# Altium project TRACTIAN_IoT.PrjPcb (part 1 of 3)
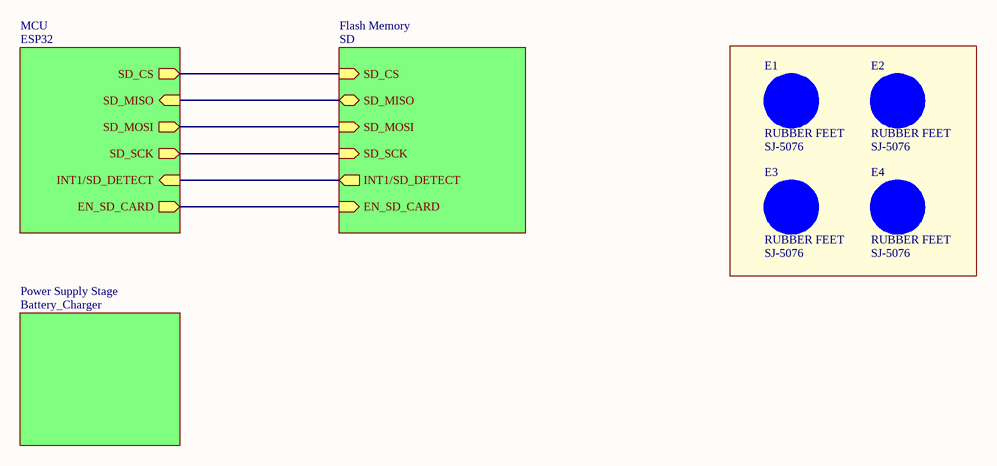
[diagram p0: main.SchDoc]
4 sheets, 60 parts. Net scope: hierarchical (ports join the sheet entries above them; power ports are global).
Board file: Tractian_IoT.PcbDoc
Sheets:
  main.SchDoc
    MCU = ESP32.SchDoc
    Power Supply Stage = Battery_Charger.SchDoc
    Flash Memory = SD.SchDoc

## Sheet main.SchDoc
size A4; SheetNumber: 1; SheetTotal: 4

### Parts
E1  RUBBER FEET  value SJ-5076  [AP8-00192]
E2  RUBBER FEET  value SJ-5076  [AP8-00192]
E3  RUBBER FEET  value SJ-5076  [AP8-00192]
E4  RUBBER FEET  value SJ-5076  [AP8-00192]

### Sub-sheets
Flash Memory = SD: INT1/SD_DETECT (out), SD_MOSI (in), EN_SD_CARD (in), SD_MISO (bidir), SD_CS (in), SD_SCK (in)
MCU = ESP32: SD_CS (out), SD_MISO (in), SD_MOSI (out), SD_SCK (out), INT1/SD_DETECT (in), EN_SD_CARD (out)
Power Supply Stage = Battery_Charger: no entries

### Nets
IO4: sheet MCU/INT1/SD_DETECT, sheet Flash Memory/INT1/SD_DETECT
IO5: sheet MCU/SD_CS, sheet Flash Memory/SD_CS
IO13: sheet MCU/EN_SD_CARD, sheet Flash Memory/EN_SD_CARD
IO18: sheet MCU/SD_SCK, sheet Flash Memory/SD_SCK
IO19: sheet MCU/SD_MISO, sheet Flash Memory/SD_MISO
IO23: sheet MCU/SD_MOSI, sheet Flash Memory/SD_MOSI

### Library data of the parts
E1-E4 = RUBBER FEET: 2.8mm adhesive feet,diam 8.0mm; PartGroup: Mechanical devices,Mounting accessories; Manufacturer: 3M; AN: A08-0053; ComponentStatus: 'Active (verified)'; Verified date: 2006-05-05; Verified by: Ketil Skjerve; Status: Active; Height: 2.79999995231628; FootprintStatus: 'Active (Verified)'

## Sheet ESP32.SchDoc
size A3; SheetNumber: 2; SheetTotal: 4
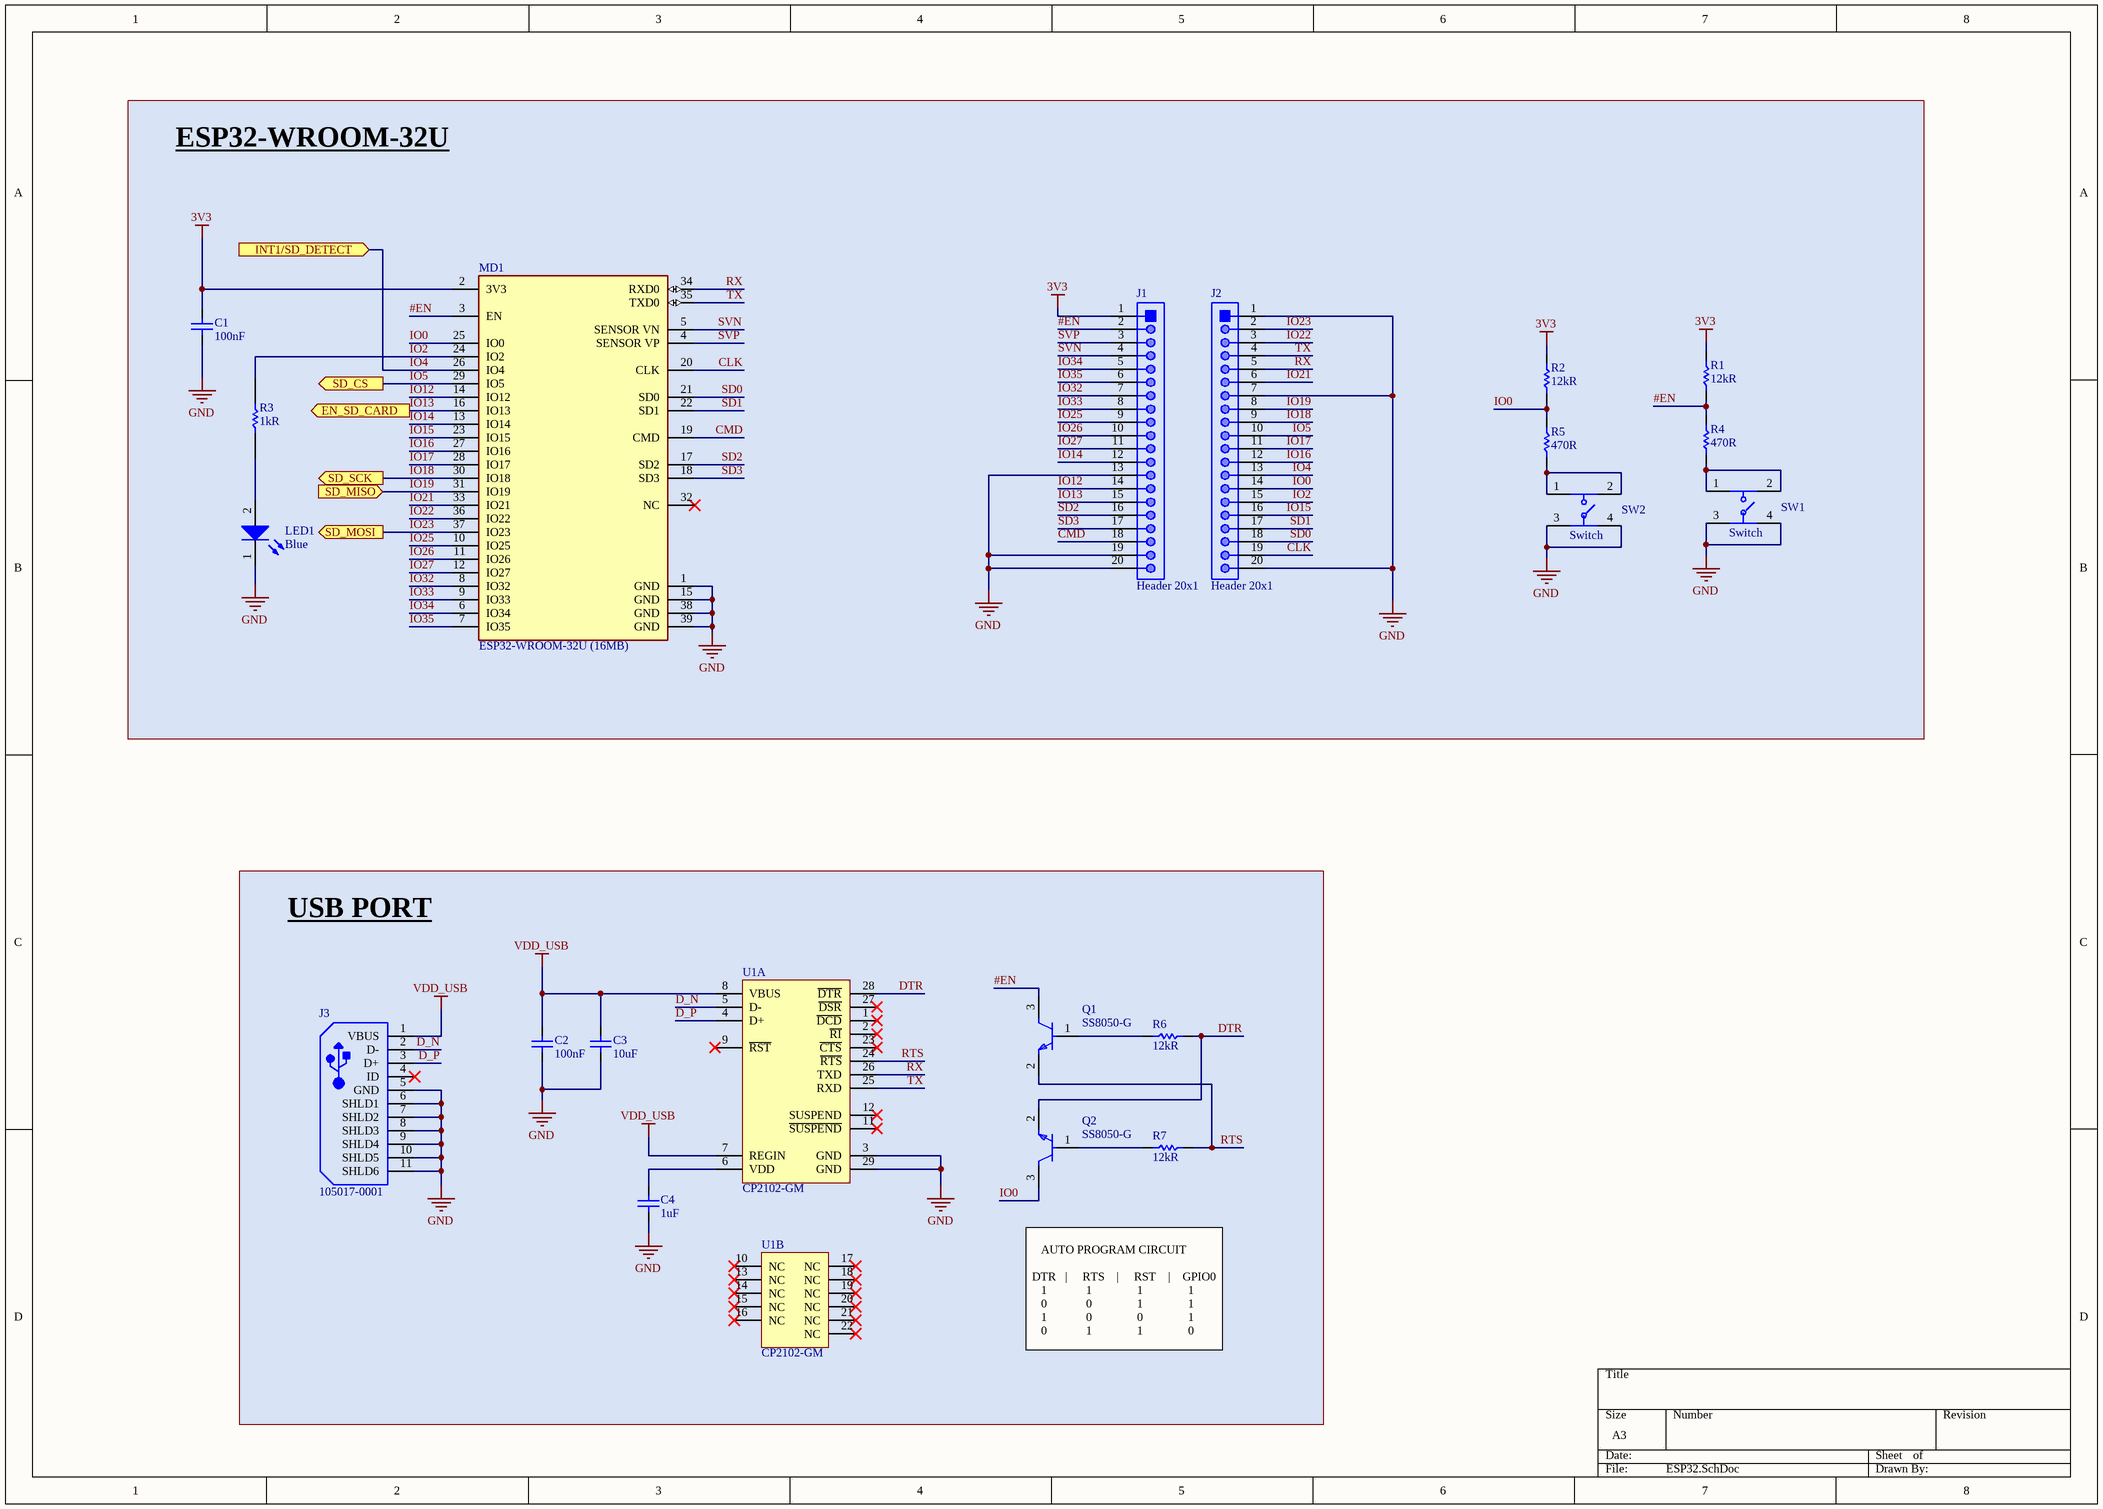
[diagram p1: ESP32.SchDoc]

### Parts
C1  100nF  [Cap 0805 (2012 Metric)]
C2  100nF  [Cap 0805 (2012 Metric)]
C3  10uF  [Cap 0805 (2012 Metric)]
C4  1uF  [Cap 0805 (2012 Metric)]
J1  Header 20x1  [Header 20x1]
J2  Header 20x1  [Header 20x1]
J3  105017-0001  [USB-MICRO-B_V]
LED1  Blue  [LED 0805(2012 METRIC)]
MD1  ESP32-WROOM-32U (16MB)  [FP-ESP32-WROOM-32U_16MB-MFG]
Q1  SS8050-G  [FP-SS8050-G-MFG]
Q2  SS8050-G  [FP-SS8050-G-MFG]
R1  12kR  [Res 0805 (2012 Metric)]
R2  12kR  [Res 0805 (2012 Metric)]
R3  1kR  [Res 0805 (2012 Metric)]
R4  470R  [Res 0805 (2012 Metric)]
R5  470R  [Res 0805 (2012 Metric)]
R6  12kR  [Res 0805 (2012 Metric)]
R7  12kR  [Res 0805 (2012 Metric)]
SW1  Switch  [Sw 4 (4.5 X 4.5mm)]
SW2  Switch  [Sw 4 (4.5 X 4.5mm)]
U1  CP2102-GM  [SLAB-QFN-28-3125x3125TP_N]  (parts A,B of 2)

### Blocks framed on the sheet
ESP32-WROOM-32U: C1 J1 J2 LED1 MD1 R1-R5 SW1 SW2
USB PORT: C2-C4 J3 Q1 Q2 R6 R7 U1

### Ports
EN_SD_CARD (out), INT1/SD_DETECT (in), SD_CS (out), SD_MISO (in), SD_MOSI (out), SD_SCK (out)

### Nets
3V3: C1.1 J1.1 MD1.2(3V3) R1.2 R2.2
GND: C1.2 C2.2 C3.2 C4.2 J1.13 J1.19 J1.20 J2.1 J2.7 J2.20 J3.5(GND) J3.6(SHLD1) J3.7(SHLD2) J3.8(SHLD3) J3.9(SHLD4) J3.10(SHLD5) J3.11(SHLD6) LED1.1(K) MD1.1(GND) MD1.15(GND) MD1.38(GND) MD1.39(GND) SW1.3 SW1.4 SW2.3 SW2.4 U1.3(GND) U1.29(GND)
VDD_USB: C2.1 C3.1 J3.1(VBUS) U1.7(REGIN) U1.8(VBUS)
#EN: J1.2 MD1.3(EN) Q1.3(C) R1.1 R4.1
CLK: J2.19 MD1.20(CLK)
CMD: J1.18 MD1.19(CMD)
D_N: J3.2(D-) U1.5(D-)
D_P: J3.3(D+) U1.4(D+)
DTR: Q2.2(E) R6.1 U1.28(~{DTR})
IO0: J2.14 MD1.25(IO0) Q2.3(C) R2.1 R5.1
IO2: J2.15 MD1.24(IO2) R3.1
IO4: J2.13 MD1.26(IO4) ; port INT1/SD_DETECT
IO5: J2.10 MD1.29(IO5) ; port SD_CS
IO12: J1.14 MD1.14(IO12)
IO13: J1.15 MD1.16(IO13) ; port EN_SD_CARD
IO14: J1.12 MD1.13(IO14)
IO15: J2.16 MD1.23(IO15)
IO16: J2.12 MD1.27(IO16)
IO17: J2.11 MD1.28(IO17)
IO18: J2.9 MD1.30(IO18) ; port SD_SCK
IO19: J2.8 MD1.31(IO19) ; port SD_MISO
IO21: J2.6 MD1.33(IO21)
IO22: J2.3 MD1.36(IO22)
IO23: J2.2 MD1.37(IO23) ; port SD_MOSI
IO25: J1.9 MD1.10(IO25)
IO26: J1.10 MD1.11(IO26)
IO27: J1.11 MD1.12(IO27)
IO32: J1.7 MD1.8(IO32)
IO33: J1.8 MD1.9(IO33)
IO34: J1.5 MD1.6(IO34)
IO35: J1.6 MD1.7(IO35)
RTS: Q1.2(E) R7.1 U1.24(~{RTS})
RX: J2.5 MD1.34(RXD0) U1.26(TXD)
SD0: J2.18 MD1.21(SD0)
SD1: J2.17 MD1.22(SD1)
SD2: J1.16 MD1.17(SD2)
SD3: J1.17 MD1.18(SD3)
SVN: J1.4 MD1.5(SENSOR_VN)
SVP: J1.3 MD1.4(SENSOR_VP)
TX: J2.4 MD1.35(TXD0) U1.25(RXD)
NetC4_1: C4.1 U1.6(VDD)
NetLED1_2: LED1.2(A) R3.2
NetQ1_1: Q1.1(B) R6.2
NetQ2_1: Q2.1(B) R7.2
NetR4_2: R4.2 SW1.1 SW1.2
NetR5_2: R5.2 SW2.1 SW2.2

Not connected (* = marked no-connect by the designer): J3 4(ID)*; MD1 32(NC)*; U1 1(~{DCD})* 2(~{RI})* 9(~{RST})* 10(NC)* 11(~{SUSPEND})* 12(SUSPEND)* 13(NC)* 14(NC)* 15(NC)* 16(NC)* 17(NC)* 18(NC)* 19(NC)* 20(NC)* 21(NC)* 22(NC)* 23(~{CTS})* 27(~{DSR})*

### Notes on the sheet
- AUTO PROGRAM CIRCUIT
  DTR   |     RTS    |     RST    |    GPIO0
  1             1               1               1
  0             0               1               1
  1             0               0               1
  0             1               1               0

### Library data of the parts
C1 C2 = Capacitor: YAGEO (PHYCOMP)         CC0805ZRY5V9BB104             SMD Multilayer Ceramic Capacitor, 0805 [2012 Metric], 0.1 uF, 50 V, +80%, -20%, Y5V, CC Series; Tolerance: 80%; Voltage Rating: 50V; Link: https://www.digikey.com/es/products/detail/yageo/CC0805ZRY5V9BB104/2103099?s=N4IgTCBcDaIMJwAwA5EFYBaAlAmmgagJwBCxAjIgCwgC6AvkA; Supplier 1: Digi-Key; Supplier Part Number 1: 311-1361-1-ND; Manufacturer: Yageo; Manufacturer Part Number: CC0805ZRY5V9BB104; RoHS: Yes; Category: Ceramic Capacitors; Stock 1: 92689; Pricing 1: 1=0,10000, 10=0,07000, 50=0,03800, 100=0,03100, 500=0,02214, 1000=0,01739 (USD); Mount: Surface Mount; Case/Package: 0805; Number of Pins: 2; Case Code (Metric): 2012; Case Code (Imperial): 0805; Material: Ceramic; Dielectric Material: Ceramic; Min Operating Temperature: -30°C; Max Operating Temperature: 85°C; Capacitance: 100nF; Dielectric: Y5V; Package Quantity: 1; Packaging: Tape and Reel; Voltage Rating (DC): 50V; Termination: SMD/SMT; Resistor Type: Ceramic; Series: CC; Construction: Flat; Length: 2mm; Width: 0.049inch; Height: 0.6mm; Depth: 1.25mm; Thickness: 0.024inch; Radiation Hardening: No; REACH SVHC: No SVHC; Lead Free: Lead Free; Halogen Free: Halogen Free; RoHS Compliant: Yes; ComponentLink1URL: https://datasheet.ciiva.com/144/mlccorderingcode-144209.pdf?src-supplier=Digi-Key; ComponentLink1Description: https://datasheet.ciiva.com/144/mlccorderingcode-144209.pdf?src-supplier=Digi-Key; ComponentLink2URL: https://datasheet.ciiva.com/144/mlccorderingcode-144210.pdf?src-supplier=Digi-Key; ComponentLink2Description: https://datasheet.ciiva.com/144/mlccorderingcode-144210.pdf?src-supplier=Digi-Key; ComponentLink3URL: https://datasheet.ciiva.com/144/mlccorderingcode-144211.pdf?src-supplier=Digi-Key; ComponentLink3Description: https://datasheet.ciiva.com/144/mlccorderingcode-144211.pdf?src-supplier=Digi-Key; ComponentLink4URL: https://datasheet.ciiva.com/11465/upy-gphc-y5v-6-3v-to-50v-5-11465865.pdf?src-supplier=Avnet; ComponentLink4Description: https://datasheet.ciiva.com/11465/upy-gphc-y5v-6-3v-to-50v-5-11465865.pdf?src-supplier=Avnet; ComponentLink5URL: https://datasheet.ciiva.com/13389/upy-gp-np0-16v-to-50v-8-13389351.pdf?src-supplier=Mouser; ComponentLink5Description: https://datasheet.ciiva.com/13389/upy-gp-np0-16v-to-50v-8-13389351.pdf?src-supplier=Mouser; ComponentLink6URL: https://datasheet.ciiva.com/17435/upy-gphc-y5v-6-3v-to-50v-5-17435053.pdf?src-supplier=Avnet+Europe; ComponentLink6Description: https://datasheet.ciiva.com/17435/upy-gphc-y5v-6-3v-to-50v-5-17435053.pdf?src-supplier=Avnet+Europe; ComponentLink7URL: https://datasheet.ciiva.com/15189/getdatasheetpartid-55882-15189238.pdf?src-supplier=Verical; ComponentLink7Description: https://datasheet.ciiva.com/15189/getdatasheetpartid-55882-15189238.pdf?src-supplier=Verical; ComponentLink8URL: https://datasheet.ciiva.com/16747/upy-gphc-y5v-6-3v-to-50v-5-revised-16747323.pdf?src-supplier=Future+Electronics; ComponentLink8Description: https://datasheet.ciiva.com/16747/upy-gphc-y5v-6-3v-to-50v-5-revised-16747323.pdf?src-supplier=Future+Electronics; ComponentLink9URL: https://datasheet.ciiva.com/28450/1132289-28450870.pdf?src-supplier=Element14; ComponentLink9Description: https://datasheet.ciiva.com/28450/1132289-28450870.pdf?src-supplier=Element14; ComponentLink10URL: https://datasheet.ciiva.com/29241/445331-da-01-en-kerko-chip-0805-y5v0-1uf-20-80proz50vg-29241946.pdf?src-supplier=Conrad; ComponentLink10Description: https://datasheet.ciiva.com/29241/445331-da-01-en-kerko-chip-0805-y5v0-1uf-20-80proz50vg-29241946.pdf?src-supplier=Conrad
C3 = Capacitor: CAP CER 10UF 10V X5R 0805; Manufacturer: KEMET; Manufacturer Part Number: C0805C106K8PACTU; Dielectric Material: Ceramic; Tolerance: 10%; Link: https://www.digikey.com/es/products/detail/kemet/C0805C106K8PACTU/1090830?s=N4IgTCBcDaIMIAYAcCCscCMCBsBpJACgIJwAqAqiALoC%2BQA; Supplier 1: Digi-Key; Supplier Part Number 1: 399-4925-1-ND; RoHS: Yes; Category: Ceramic Capacitors; Stock 1: 1166327; Pricing 1: 1=0,15000, 10=0,10600, 50=0,06040, 100=0,05000, 500=0,03508, 1000=0,02904 (USD); Mount: Surface Mount; Case/Package: 0805; Number of Pins: 2; Case Code (Imperial): 0805; Case Code (Metric): 2012; Contact Plating: Tin,Matte; Min Operating Temperature: -55°C; Max Operating Temperature: 85°C; Capacitance: 10uF; Packaging: Tape and Reel; Voltage Rating (DC): 10V; Termination: SMD/SMT; Package Quantity: 1; Voltage Rating: 10V; Voltage: 10V; Series: C; Dielectric: X5R; Construction: Flat; Dissipation Factor: 10%; Length: 2mm; Width: 1.2mm; Height: 1.25mm; Depth: 1.25mm; Thickness: 0.055inch; Radiation Hardening: No; REACH SVHC: No SVHC; RoHS Compliant: Yes; ComponentLink1URL: https://datasheet.ciiva.com/7842/1732709-7842198.pdf?src-supplier=Element14; ComponentLink1Description: https://datasheet.ciiva.com/7842/1732709-7842198.pdf?src-supplier=Element14; ComponentLink2URL: https://datasheet.ciiva.com/7842/40889-7842552.pdf?src-supplier=Element14; ComponentLink2Description: https://datasheet.ciiva.com/7842/40889-7842552.pdf?src-supplier=Element14; ComponentLink3URL: https://datasheet.ciiva.com/22704/1732709-22704859.pdf?src-supplier=Element14; ComponentLink3Description: https://datasheet.ciiva.com/22704/1732709-22704859.pdf?src-supplier=Element14
C4 = Capacitor: Ceramic capacitor SMD-0805 1000nF /16V X7R# K +-10%, Samsung, RoHS/3000pcs/; Manufacturer Part Number: CL21B105KOFNNNG; Voltage Rating: 16V; Tolerance: 10%; Dielectric: X7R; Link: https://www.digikey.com/es/products/detail/samsung-electro-mechanics/CL21B105KOFNNNG/3894469?s=N4IgTCBcDaIMIBkwEYBCyAMBWA0geQDEA5EgcRAF0BfIA; Supplier 1: Digi-Key; Supplier Part Number 1: 1276-6471-1-ND; Manufacturer: Samsung; RoHS: Yes; Category: Ceramic Capacitors; Stock 1: 36000; Pricing 1: 1=0,10000, 10=0,05700, 50=0,03120, 100=0,02540, 500=0,01816, 1000=0,01426 (USD); Mount: Surface Mount; Case/Package: 0805; Case Code (Metric): 2012; Case Code (Imperial): 0805; Material: Ceramic; Min Operating Temperature: -55°C; Max Operating Temperature: 125°C; Package Quantity: 3000; Packaging: Tape and Reel; Capacitance: 1uF; Voltage: 16V; Series: CL; Length: 2mm; Width: 0.049inch; Height: 1.25mm; Thickness: 0.053inch; Depth: 1.25mm; Lead Free: Lead Free; ComponentLink1URL: https://datasheet.ciiva.com/25733/cl21b105kofnnng-25733281.pdf?src-supplier=Digi-Key; ComponentLink1Description: https://datasheet.ciiva.com/25733/cl21b105kofnnng-25733281.pdf?src-supplier=Digi-Key; ComponentLink2URL: https://datasheet.ciiva.com/29199/455935-da-01-en-vs-kondensator-0805-29199047.pdf?src-supplier=Conrad; ComponentLink2Description: https://datasheet.ciiva.com/29199/455935-da-01-en-vs-kondensator-0805-29199047.pdf?src-supplier=Conrad; ComponentLink3URL: https://datasheet.ciiva.com/16428/cl05b104kq5nnnc-16428885.pdf?src-supplier=Future+Electronics; ComponentLink3Description: https://datasheet.ciiva.com/16428/cl05b104kq5nnnc-16428885.pdf?src-supplier=Future+Electronics; ComponentLink4URL: https://datasheet.ciiva.com/26310/mlcc-catalogdownload2013-eng-26310156.pdf?src-supplier=Distrelec; ComponentLink4Description: https://datasheet.ciiva.com/26310/mlcc-catalogdownload2013-eng-26310156.pdf?src-supplier=Distrelec
J3 = CMP-2000-05827-1: Micro-USB B Receptacle, Right Angle, Bottom Mount, Surface Mount, with Solder Tabs, -30 to 85 degC, 5-Pin USB, RoHS, Tape and Reel; Manufacturer: Molex; Featured Product: Micro-USBConnectorsUSBConnectors; Other Names: WM1399DKR; Package Version: Rev. F, 12/2012; Number of Contacts: 5; Connector Type: USB-microB; Catalog Drawings: 1050170001; 3D Model: 105017-0001.stp; Mating Products: WM17145-ND-CABLEMICROUSBBTOSTDA1.0MWM17147-ND-CABLEMICROUSBBTOSTDA2.0MWM17146-ND-CABLEMICROUSBBTOSTDA1.5M; PCN Assembly/Origin: ResinSupplier21/Oct/2015; Voltage - Max: 30V; Online Catalog: Molex-MicroUSB; Manufacturer URL: http://www.molex.com/; Package Description: 5-Leads USB, Micro B, Body 7.5 x 5 mm, Pitch 0.65 mm; Datasheet URL: http://www.molex.com/elqNow/elqRedir.htm?ref=http://www.molex.com/webdocs/datasheets/pdf/en-us/1050170001_IO_CONNECTORS.pdf; Ingress Protection: -; Datasheet Version: 03/2016; Mounting Type: BoardCutout,SurfaceMount,RightAngle; Circuits: 5; Standard Package: 1; Package Reference: MICRO-B; Package URL: http://www.molex.com/pdm_docs/sd/1050170001_sd.pdf; Category: Connectors,Interconnects; Series: -; RoHS Information: 1050170001CertofCompliance; Features: Shielded,SolderRetention; Family: USB,DVI,HDMIConnectors; Specifications: -; Gender: Receptacle; Packaging: Digi-Reel®; Mounting Technology: SurfaceMount; Manufacturer Part Number: 1050170001; Link: https://www.digikey.com/es/products/detail/molex/1050170001/2350832?s=N4IgTCBcDaIIwAYCsC4HYC0DtxAXQF8g
LED1 = LED: SMD LED blue 3.5 V 0805, 150080BS75000, Würth Elektronik; Manufacturer: Wurth Electronics; Luminous Intensity: 145mcd; Viewing Angle: 140°; Forward Voltage: 3.2V; Wavelength: 470nm; Lens Style: Clear,Rectangular; Forward Current: 30mA; Test Current: 20mA; Link: https://www.digikey.com/products/en/optoelectronics/led-indication-discrete/105?k=150080BS75000&k=&pkeyword=150080BS75000&sv=0&pv7=2&sf=0&quantity=&ColumnSort=0&page=1&pageSize=25; Supplier 1: Digi-Key; Supplier Part Number 1: 732-4982-1-ND; Manufacturer Part Number: 150080BS75000; RoHS: Yes; Category: LEDs; Stock 1: 30224; Pricing 1: 1=0,18000, 50=0,16500, 100=0,14200, 500=0,12300 (USD); Mount: Surface Mount; Case/Package: 0805; Color: Blue; Case Code (Metric): 2012; Case Code (Imperial): 0805; Min Operating Temperature: -40°C; Max Operating Temperature: 85°C; Package Quantity: 4000; Packaging: Tape and Reel; Dominant Wavelength: 470nm; Length: 2mm; Height: 0.7mm; Width: 1.25mm; REACH SVHC: Unknown; Lead Free: Lead Free; ComponentLink1URL: https://datasheet.ciiva.com/23843/150080bs75000-23843251.pdf?src-supplier=Newark; ComponentLink1Description: https://datasheet.ciiva.com/23843/150080bs75000-23843251.pdf?src-supplier=Newark; ComponentLink2URL: https://datasheet.ciiva.com/22656/1740214-22656954.pdf?src-supplier=Element14; ComponentLink2Description: https://datasheet.ciiva.com/22656/1740214-22656954.pdf?src-supplier=Element14; ComponentLink3URL: https://datasheet.ciiva.com/29279/759433-da-01-en-chipled-0805-w-kl-blau-150080bs75000-29279203.pdf?src-supplier=Conrad; ComponentLink3Description: https://datasheet.ciiva.com/29279/759433-da-01-en-chipled-0805-w-kl-blau-150080bs75000-29279203.pdf?src-supplier=Conrad; ComponentLink4URL: https://datasheet.ciiva.com/29562/150080bs75000-29562922.pdf?src-supplier=Digi-Key; ComponentLink4Description: https://datasheet.ciiva.com/29562/150080bs75000-29562922.pdf?src-supplier=Digi-Key; ComponentLink5URL: https://datasheet.ciiva.com/29562/150080bs75000-29562923.pdf?src-supplier=Digi-Key; ComponentLink5Description: https://datasheet.ciiva.com/29562/150080bs75000-29562923.pdf?src-supplier=Digi-Key
MD1 = CMP-194065-000029-1: RX TXRX MODULE WIFI U.FL SMD; Manufacturer Part Number: ESP32-WROOM-32U-N4; Sensitivity: -98dBm; Frequency: 2.5GHz; Memory Size: 536KB; Data Rate: 150Mbps; Interface: I2C; Packaging: Tape and Reel; Case/Package: SMD/SMT; Max Operating Temperature: 85°C; Mount: Surface Mount; Min Operating Temperature: -40°C; Link: https://www.digikey.com/es/products/detail/espressif-systems/ESP32-WROOM-32U-N4/9381719
Q1 Q2 = CMP-20235-000001-1: NPN TRANSISTOR 1.5A 40V SOT-23 R; Transition Frequency: 100MHz; Max Breakdown Voltage: 25V; Collector Emitter Voltage (VCEO): 400mV; Max Power Dissipation: 300mW; Max Collector Current: 1.5A; Case/Package: TO-236-3; Packaging: Tape and Reel; RoHS Compliant: Yes; Mount: Surface Mount; Collector Emitter Breakdown Voltage: 25V; Manufacturer Part Number: SS8050-G; Link: https://www.digikey.com/es/products/detail/comchip-technology/SS8050-G/6138901?s=N4IgTCBcDaIMpwBwAYCsyC0BxEBdAvkA
R1 R2 R6 R7 = Resistor: 贴片电阻 12000Ω ± 1.00% 0.125W ± 100ppm/℃ 0805; Manufacturer: Yageo; Manufacturer Part Number: RC0805FR-0712KL; Tolerance: 1%; Temperature Coefficient: 100ppm/°C; Max Power Dissipation: 125mW; Voltage Rating: 150V; Link: https://www.digikey.com/es/products/detail/yageo/RC0805FR-0712KL/727568?s=N4IgTCBcDaIEoGEAMAOJBWAYnAtEg7AIxgDSAMiALoC%2BQA; Supplier 1: RSComponents; Supplier Part Number 1: 1995652; RoHS: Yes; Category: Chip SMD Resistors; Stock 1: 300; Pricing 1: 5000=0,00400, 25000=0,00400, 50000=0,00400, 100000=0,00300, 200000=0,00300 (GBP); Case/Package: 0805; Case Code (Imperial): 0805; Case Code (Metric): 2012; Weight: 0.000194oz; Size Code: 0805; Min Operating Temperature: -55°C; Max Operating Temperature: 155°C; Resistance: 12kR; Packaging: Tape and Reel; Package Quantity: 1; Resistor Type: Thick Film; Number of Terminations: 2; Series: RC; Features: Moisture Resistant; Power Rating: 125mW; Termination: SMD/SMT; Construction: Rectangular; Resistance Tolerance: 1%; Length: 2mm; Width: 1.25mm; Height: 0.024inch; Depth: 1.25mm; RoHS Compliant: Yes; Lead Free: Lead Free; Military Standard: Not; REACH SVHC: Unknown; ComponentLink1URL: https://datasheet.ciiva.com/2519/pyu-r-int-thick-7-2519832.pdf?src-supplier=Digi-Key; ComponentLink1Description: https://datasheet.ciiva.com/2519/pyu-r-int-thick-7-2519832.pdf?src-supplier=Digi-Key; ComponentLink2URL: https://datasheet.ciiva.com/2519/pyu-r-int-thick-7-2519833.pdf?src-supplier=Digi-Key; ComponentLink2Description: https://datasheet.ciiva.com/2519/pyu-r-int-thick-7-2519833.pdf?src-supplier=Digi-Key; ComponentLink3URL: https://datasheet.ciiva.com/2519/pyu-r-int-thick-7-2519831.pdf?src-supplier=Digi-Key; ComponentLink3Description: https://datasheet.ciiva.com/2519/pyu-r-int-thick-7-2519831.pdf?src-supplier=Digi-Key; ComponentLink4URL: https://datasheet.ciiva.com/12577/rc0805-12577253.pdf?src-supplier=Mouser; ComponentLink4Description: https://datasheet.ciiva.com/12577/rc0805-12577253.pdf?src-supplier=Mouser; ComponentLink5URL: https://datasheet.ciiva.com/7941/444164-7941693.pdf?src-supplier=Element14; ComponentLink5Description: https://datasheet.ciiva.com/7941/444164-7941693.pdf?src-supplier=Element14; ComponentLink6URL: https://datasheet.ciiva.com/7941/444164-7941694.pdf?src-supplier=Element14; ComponentLink6Description: https://datasheet.ciiva.com/7941/444164-7941694.pdf?src-supplier=Element14; ComponentLink7URL: https://datasheet.ciiva.com/17018/rc0805-17018634.pdf?src-supplier=Future+Electronics; ComponentLink7Description: https://datasheet.ciiva.com/17018/rc0805-17018634.pdf?src-supplier=Future+Electronics
R3 = Resistor: 1 kOhms ±1% 0.25W, 1/4W Chip Resistor 0805 (2012 Metric) Anti-Sulfur, Moisture Resistant Thin Film; Manufacturer: Stackpole Electronics; Manufacturer Part Number: RNCP0805FTD1K00; Max Power Dissipation: 250mW; Temperature Coefficient: 100ppm/°C; Link: https://www.digikey.com/product-detail/en/stackpole-electronics-inc/RNCP0805FTD1K00/RNCP0805FTD1K00CT-ND/2240568; Supplier 1: Digi-Key; Supplier Part Number 1: RNCP0805FTD1K00CT-ND; RoHS: Yes; Category: Chip SMD Resistors; Stock 1: 391019; Pricing 1: 1=0,10000, 10=0,06900, 100=0,02640, 1000=0,01162, 2500=0,01003 (USD); Mount: Surface Mount; Case/Package: 0805; Case Code (Metric): 2012; Case Code (Imperial): 0805; Min Operating Temperature: -55°C; Max Operating Temperature: 155°C; Features: Moisture Resistant,Anti-Sulfur; Composition: Thin Film; Number of Terminations: 2; Tolerance: 1%; Resistance: 1kR; Power Rating: 250mW; Packaging: Tape and Reel; Length: 0.079inch; Height: 0.024inch; Width: 0.049inch; Lead Free: Lead Free; ComponentLink1URL: http://www.seielect.com/Catalog/SEI-rncp.pdf?src-supplier=Future+Electronics; ComponentLink1Description: http://www.seielect.com/Catalog/SEI-rncp.pdf?src-supplier=Future+Electronics; ComponentLink2URL: https://www.seielect.com/catalog/SEI-Packaging.pdf?src-supplier=Digi-Key; ComponentLink2Description: https://www.seielect.com/catalog/SEI-Packaging.pdf?src-supplier=Digi-Key; ComponentLink3URL: https://www.seielect.com/Catalog/SEI-rncp.pdf?src-supplier=Digi-Key; ComponentLink3Description: https://www.seielect.com/Catalog/SEI-rncp.pdf?src-supplier=Digi-Key
R4 R5 = Resistor: 贴片电阻 470Ω ±1% 1/8W ±100ppm/℃ 0805; Manufacturer: Panasonic; Manufacturer Part Number: ERJ-6ENF4700V; Power Rating: 125mW; Voltage Rating: 150V; Temperature Coefficient: 100ppm/°C; Link: https://www.digikey.com/es/products/detail/panasonic-electronic-components/ERJ-6ENF4700V/1746508?s=N4IgTCBcDaIKICUBSBaAbHAcgMQCwHYAGQgNRAF0BfIA; Supplier 1: Newark; Supplier Part Number 1: 85Y9296; RoHS: Yes; Category: Chip SMD Resistors; Stock 1: 160000; Pricing 1: 1=0,01600, 5000=0,01600, 10000=0,01400 (USD); Mount: Surface Mount; Case/Package: 0805; Number of Pins: 2; Case Code (Metric): 2012; Case Code (Imperial): 0805; Contact Plating: Tin; Weight: 0.000194oz; Min Operating Temperature: -55°C; Max Operating Temperature: 155°C; Resistance: 470R; Tolerance: 1%; Packaging: Tape and Reel; Package Quantity: 1; Resistor Type: Thick Film; Number of Terminations: 2; Termination: SMD/SMT; Max Power Dissipation: 125mW; Series: ERJ; Resistance Tolerance: 1%; Construction: Rectangular; Voltage Rating (DC): 150V; Features: Automotive AEC-Q200; Technology: THICK FILM; Length: 2mm; Width: 0.049inch; Height: 0.6mm; Depth: 1.25mm; Radiation Hardening: No; REACH SVHC: No SVHC; Military Standard: Not; RoHS Compliant: Yes; Lead Free: Lead Free; ComponentLink1URL: https://datasheet.ciiva.com/34303/1989332-34303633.pdf?src-supplier=Jameco; ComponentLink1Description: https://datasheet.ciiva.com/34303/1989332-34303633.pdf?src-supplier=Jameco; ComponentLink2URL: https://datasheet.ciiva.com/11821/0900766b80f80784-11821642.pdf?src-supplier=RSComponents; ComponentLink2Description: https://datasheet.ciiva.com/11821/0900766b80f80784-11821642.pdf?src-supplier=RSComponents; ComponentLink3URL: https://datasheet.ciiva.com/7830/426256-7830749.pdf?src-supplier=Element14; ComponentLink3Description: https://datasheet.ciiva.com/7830/426256-7830749.pdf?src-supplier=Element14; ComponentLink4URL: https://datasheet.ciiva.com/7830/1678782-7830991.pdf?src-supplier=Element14; ComponentLink4Description: https://datasheet.ciiva.com/7830/1678782-7830991.pdf?src-supplier=Element14; ComponentLink5URL: https://datasheet.ciiva.com/22668/1678782-22668335.pdf?src-supplier=Element14; ComponentLink5Description: https://datasheet.ciiva.com/22668/1678782-22668335.pdf?src-supplier=Element14; ComponentLink6URL: https://datasheet.ciiva.com/22687/1678782-22687451.pdf?src-supplier=Element14; ComponentLink6Description: https://datasheet.ciiva.com/22687/1678782-22687451.pdf?src-supplier=Element14; ComponentLink7URL: https://datasheet.ciiva.com/24124/aoa0000ce2-24124316.pdf?src-supplier=Mouser; ComponentLink7Description: https://datasheet.ciiva.com/24124/aoa0000ce2-24124316.pdf?src-supplier=Mouser; ComponentLink8URL: https://datasheet.ciiva.com/16783/70260748-16783246.pdf?src-supplier=Allied+Electronics; ComponentLink8Description: https://datasheet.ciiva.com/16783/70260748-16783246.pdf?src-supplier=Allied+Electronics; ComponentLink9URL: https://datasheet.ciiva.com/16767/70260748-16767755.pdf?src-supplier=Allied+Electronics; ComponentLink9Description: https://datasheet.ciiva.com/16767/70260748-16767755.pdf?src-supplier=Allied+Electronics; ComponentLink10URL: https://datasheet.ciiva.com/9181/aoa0000ce2-9181798.pdf?src-supplier=Avnet; ComponentLink10Description: https://datasheet.ciiva.com/9181/aoa0000ce2-9181798.pdf?src-supplier=Avnet
SW1 SW2 = Switch: Switch Tactile N.O. SPST Round Button Gull Wing 0.05A 12VDC 100000Cycles 2.45N SMD T/R; Manufacturer: ITT C&K; Manufacturer Part Number: PTS647SK38SMTR2LFS; Illumination Type: Non-Illuminated; Switch Function: Off-Mom; Actuator Type: Standard; Operating Force: 250gf; Switch Travel: 0.25mm; Ratings: IP40; Link: https://www.digikey.com/product-detail/en/c-k/PTS-647-SK38-SMTR2-LFS/PTS647SK38SMTR2LFSCT-ND/9649871; Supplier 1: Digi-Key; Supplier Part Number 1: PTS647SK38SMTR2LFSCT-ND; RoHS: No; Category: Tactile Switches; Stock 1: 18941; Pricing 1: 1=0,13000, 10=0,12700, 25=0,12080, 100=0,10970, 250=0,10308, 500=0,09432, 1000=0,07897 (USD); Mount: Surface Mount; Mechanical Life: 100000Cycles; Min Operating Temperature: -20°C; Max Operating Temperature: 70°C; Throw Configuration: SPST; Packaging: Tape and Reel; Termination: Gull Wing; ComponentLink1URL: https://www.ckswitches.com/media/2567/pts647.pdf?src-supplier=Digi-Key; ComponentLink1Description: https://www.ckswitches.com/media/2567/pts647.pdf?src-supplier=Digi-Key
U1 = CMP-0511-00012-1: Single-Chip USB to UART Bridge, 1024 Bytes EEPROM, -40 to 85 degC, 28-pin QFN, Tube; Manufacturer: Silicon Labs; Internal Oscillator: TRUE; Sub-Family: USB Bridges; ComponentLink3Description: Package Specification; PackageDescription: 28-Pin Quad-Flat No-Leads Package, Body 5 x 5 mm, Pitch 0.5 mm; PartNumber: CP2102-GM; EEPROM: 1024 Bytes; Mounting Technology: Surface Mount; ComponentLink2URL: http://www.silabs.com/Support%20Documents/TechnicalDocs/CP2102-9.pdf; DatasheetVersion: Rev. 1.5; ComponentLink1URL: http://www.silabs.com/; ComponentLink2Description: Datasheet; Code_JEDEC: MO-220; PackageReference: QFN-28; Code_IPC: J-STD-020C; ComponentLink3URL: http://www.silabs.com/Support%20Documents/TechnicalDocs/C8051T61x.pdf; ComponentLink1Description: Manufacturer URL; Manufacturer Part Number: CP2102-GM; Link: https://www.digikey.com/es/products/detail/silicon-labs/CP2102-GM/696598